# Altium schematic sheet ADC.SchDoc
size 292 x 193 mm; DocumentNumber: 3; SheetNumber: 3; SheetTotal: 11
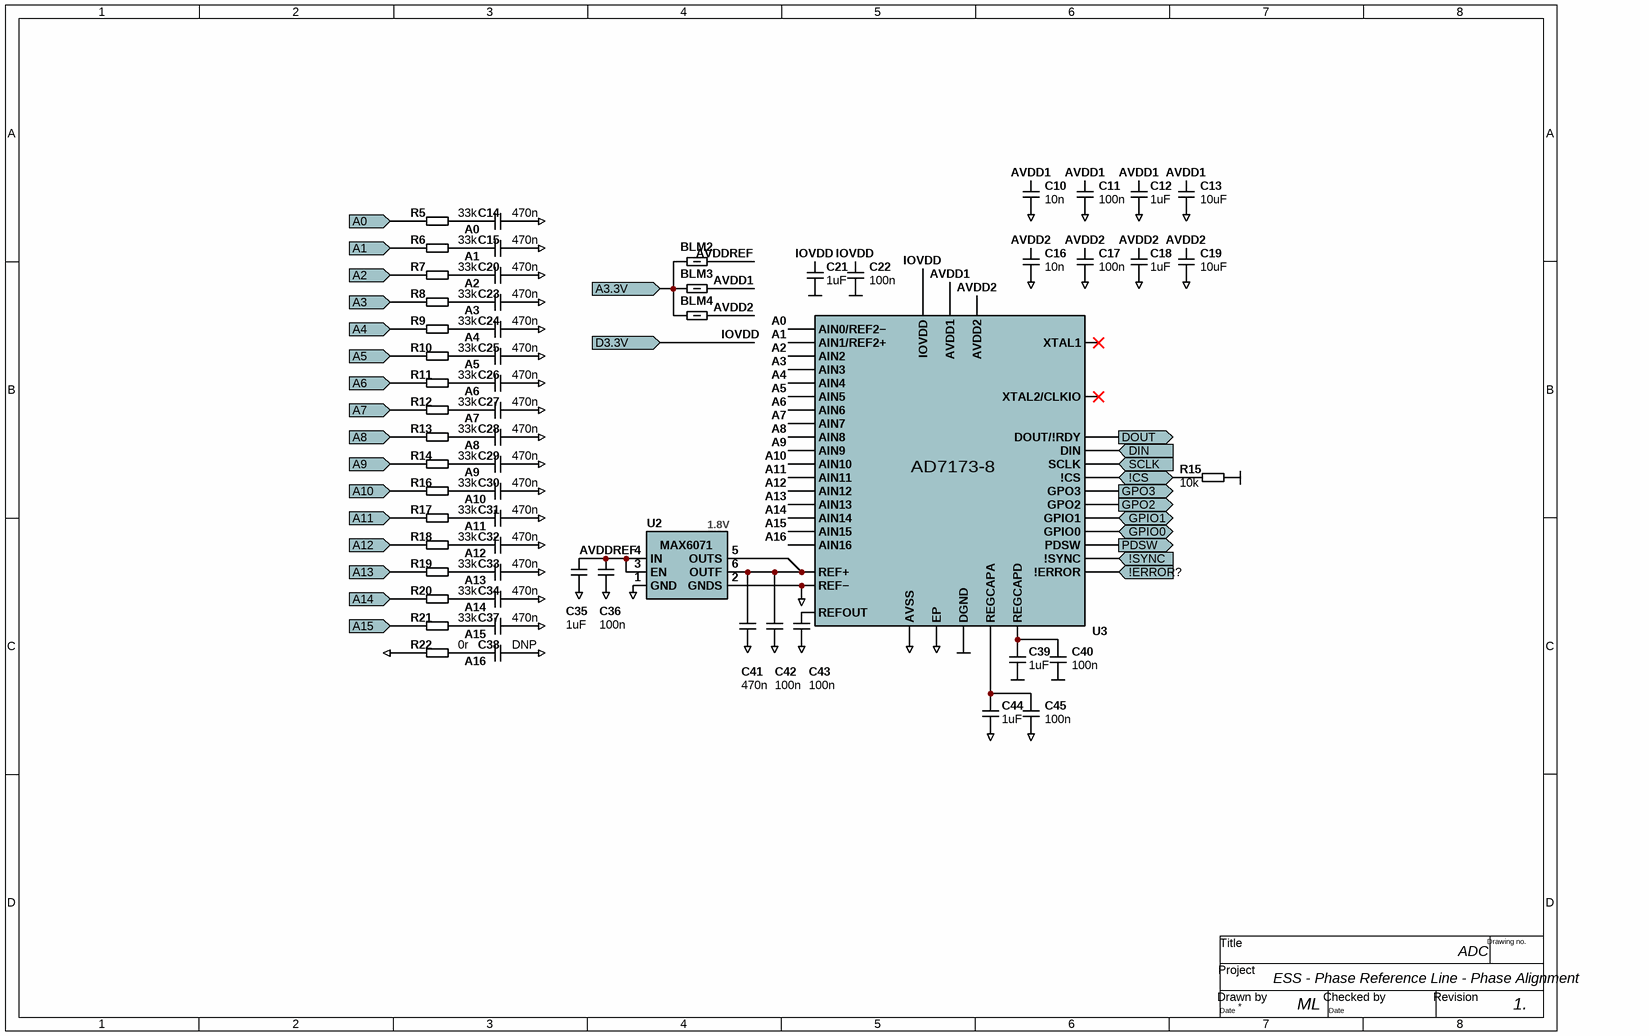
[diagram p0: ADC.SchDoc]

## Parts
BLM2  120 Ohms @ 100MHz  [0402-Inductor]  (value not drawn)
BLM3  120 Ohms @ 100MHz  [0402-Inductor]  (value not drawn)
BLM4  120 Ohms @ 100MHz  [0402-Inductor]  (value not drawn)
C10  10n  [0402-Capacitor]  (net tie, no BOM)
C11  100n  [0402-Capacitor]  (net tie, no BOM)
C12  1uF  [0805-Capacitor]
C13  10uF  [1206-capacitor]
C14  470n  [0402-Capacitor]
C15  470n  [0402-Capacitor]
C16  10n  [0402-Capacitor]  (net tie, no BOM)
C17  100n  [0402-Capacitor]  (net tie, no BOM)
C18  1uF  [0805-Capacitor]
C19  10uF  [1206-capacitor]
C20  470n  [0402-Capacitor]
C21  1uF  [0805-Capacitor]
C22  100n  [0402-Capacitor]  (net tie, no BOM)
C23  470n  [0402-Capacitor]
C24  470n  [0402-Capacitor]
C25  470n  [0402-Capacitor]
C26  470n  [0402-Capacitor]
C27  470n  [0402-Capacitor]
C28  470n  [0402-Capacitor]
C29  470n  [0402-Capacitor]
C30  470n  [0402-Capacitor]
C31  470n  [0402-Capacitor]
C32  470n  [0402-Capacitor]
C33  470n  [0402-Capacitor]
C34  470n  [0402-Capacitor]
C35  1uF  [0805-Capacitor]
C36  100n  [0402-Capacitor]  (net tie, no BOM)
C37  470n  [0402-Capacitor]
C38  DNP  [0402-Capacitor]  (net tie, no BOM)
C39  1uF  [0805-Capacitor]
C40  100n  [0402-Capacitor]  (net tie, no BOM)
C41  470n  [0402-Capacitor]  (net tie, no BOM)
C42  100n  [0402-Capacitor]  (net tie, no BOM)
C43  100n  [0402-Capacitor]  (net tie, no BOM)
C44  1uF  [0805-Capacitor]
C45  100n  [0402-Capacitor]  (net tie, no BOM)
R5  33k  [0402-RESISTOR]
R6  33k  [0402-RESISTOR]
R7  33k  [0402-RESISTOR]
R8  33k  [0402-RESISTOR]
R9  33k  [0402-RESISTOR]
R10  33k  [0402-RESISTOR]
R11  33k  [0402-RESISTOR]
R12  33k  [0402-RESISTOR]
R13  33k  [0402-RESISTOR]
R14  33k  [0402-RESISTOR]
R15  10k  [0603-RESISTOR]
R16  33k  [0402-RESISTOR]
R17  33k  [0402-RESISTOR]
R18  33k  [0402-RESISTOR]
R19  33k  [0402-RESISTOR]
R20  33k  [0402-RESISTOR]
R21  33k  [0402-RESISTOR]
R22  0r  [0402-RESISTOR]
U2  MAX6071  [SOT-23-6]  (value not drawn)
U3  AD7173-8  [LFCSP-40]  (value not drawn)

## Ports
!CS (bidir), !ERROR? (in), !SYNC (in), A0 (in), A1 (in), A2 (in), A3 (in), A3.3V (in), A4 (in), A5 (in), A6 (in), A7 (in), A8 (in), A9 (in), A10 (in), A11 (in), A12 (in), A13 (in), A14 (in), A15 (in), D3.3V (in), DIN (in), DOUT (out), GPIO0 (bidir), GPIO1 (bidir), GPO2 (out), GPO3 (out), PDSW (out), SCLK (in)

## Nets
DGND: C21.2 C22.1 C39.2 C40.1 R15.2 U3.21(DGND)
GND: C10.1 C11.1 C12.2 C13.2 C14.2 C15.2 C16.1 C17.1 C18.2 C19.2 C20.2 C23.2 C24.2 C25.2 C26.2 C27.2 C28.2 C29.2 C30.2 C31.2 C32.2 C33.2 C34.2 C35.2 C36.1 C37.2 C38.2 C41.1 C42.1 C43.1 C44.2 C45.1 R22.1 U2.1(GND) U2.2(GNDS) U3.8(AVSS) U3.39(REF−) U3.EP
!CS: R15.1 U3.17(!CS) ; port !CS
!ERROR?: U3.18(!ERROR) ; port !ERROR?
!SYNC: U3.19(!SYNC) ; port !SYNC
A0: R5.1 ; port A0
A0: C14.1 R5.2 U3.2(AIN0/REF2−)  [a separate net that carries the same name]
A1: R6.1 ; port A1
A1: C15.1 R6.2 U3.3(AIN1/REF2+)  [a separate net that carries the same name]
A2: R7.1 ; port A2
A2: C20.1 R7.2 U3.4(AIN2)  [a separate net that carries the same name]
A3: R8.1 ; port A3
A3: C23.1 R8.2 U3.5(AIN3)  [a separate net that carries the same name]
A3.3V: BLM2.1 BLM3.1 BLM4.1 ; port A3.3V
A4: R9.1 ; port A4
A4: C24.1 R9.2 U3.26(AIN4)  [a separate net that carries the same name]
A5: R10.1 ; port A5
A5: C25.1 R10.2 U3.27(AIN5)  [a separate net that carries the same name]
A6: R11.1 ; port A6
A6: C26.1 R11.2 U3.28(AIN6)  [a separate net that carries the same name]
A7: R12.1 ; port A7
A7: C27.1 R12.2 U3.29(AIN7)  [a separate net that carries the same name]
A8: R13.1 ; port A8
A8: C28.1 R13.2 U3.30(AIN8)  [a separate net that carries the same name]
A9: R14.1 ; port A9
A9: C29.1 R14.2 U3.31(AIN9)  [a separate net that carries the same name]
A10: R16.1 ; port A10
A10: C30.1 R16.2 U3.32(AIN10)  [a separate net that carries the same name]
A11: R17.1 ; port A11
A11: C31.1 R17.2 U3.33(AIN11)  [a separate net that carries the same name]
A12: R18.1 ; port A12
A12: C32.1 R18.2 U3.34(AIN12)  [a separate net that carries the same name]
A13: R19.1 ; port A13
A13: C33.1 R19.2 U3.35(AIN13)  [a separate net that carries the same name]
A14: R20.1 ; port A14
A14: C34.1 R20.2 U3.36(AIN14)  [a separate net that carries the same name]
A15: R21.1 ; port A15
A15: C37.1 R21.2 U3.37(AIN15)  [a separate net that carries the same name]
A16: C38.1 R22.2 U3.1(AIN16)
AVDD1: BLM3.2 C10.2 C11.2 C12.1 C13.1 U3.9(AVDD1)
AVDD2: BLM4.2 C16.2 C17.2 C18.1 C19.1 U3.10(AVDD2)
AVDDREF: BLM2.2 C35.1 C36.2 U2.3(EN) U2.4(IN)
DIN: U3.15(DIN) ; port DIN
DOUT: U3.14(DOUT/!RDY) ; port DOUT
GPIO0: U3.23(GPIO0) ; port GPIO0
GPIO1: U3.24(GPIO1) ; port GPIO1
GPO2: U3.25(GPO2) ; port GPO2
GPO3: U3.38(GPO3) ; port GPO3
IOVDD: C21.1 C22.2 U3.20(IOVDD) ; port D3.3V
PDSW: U3.11(PDSW) ; port PDSW
SCLK: U3.16(SCLK) ; port SCLK
NetC39_1: C39.1 C40.2 U3.22(REGCAPD)
NetC41_2: C41.2 C42.2 U2.5(OUTS) U2.6(OUTF) U3.40(REF+)
NetC43_2: C43.2 U3.6(REFOUT)
NetC44_1: C44.1 C45.2 U3.7(REGCAPA)

Not connected (* = marked no-connect by the designer): U3 12(XTAL1)* 13(XTAL2/CLKIO)*

## Notes on the sheet
- (near U2) 1.8V
- ESS - Phase Reference Line - Phase Alignment
- ADC
- ML
- 1.
- Title
- Project
- Drawing no.
- Date
- Drawn by
- Checked by
- Revision

## Library data of the parts
BLM2-BLM4 = BLM15AX121SZ1D: 120 Ohms @ 100MHz 1 Power, Signal Line Ferrite Bead 0402 (1005 Metric) 700mA 130mOhm; Case: 0402; Supplier 1: Digi-Key; Supplier Part Number 1: 490-16510-1-ND; HelpURL: https://www.murata.com/en-us/products/productdata/8796748677150/QNFA9118.pdf
C10 C11 C14-C17 C20 C22-C34 C36 C37 C40-C43 C45 = C_0402: Capacitor 0402; Dielectric: X7R/C0G; Tolerance: ±20%; Voltage Rating: 16V; Case: 0402
  C10 C16: Value: 10n
  C11 C17 C22 C36 C40 C42 C43 C45: Value: 100n
  C14 C15 C20 C23-C34 C37 C41: Value: 470n
C12 C18 C21 C35 C39 C44 = C_0805: Capacitor 0805; Dielectric: X7R/C0G; Tolerance: ±20%; Voltage Rating: 16V; Value: 1uF; Case: 0805
C13 C19 = C_1206: Capacitor 1206; Voltage Rating: 16V; Dielectric: X7R/C0G; Tolerance: ±20%; Value: 10uF; Case: 1206
C38 = C_0402: Capacitor 0402; Value: 470n; Dielectric: X7R/C0G; Tolerance: ±20%; Voltage Rating: 16V; Case: 0402
R5-R14 R16-R22 = R_0402: Resistor 0402; Tolerance: ±1%; Case: 0402
  R5-R14 R16-R21: Value: 33k
  R22: Value: 0r
R15 = R_0603: Resistor 0603; Tolerance: ±1%; Value: 10k; Case: 0603
U2 = MAX6071-1.8: Low-Noise, High-Precision Series / 1.8V Voltage Reference; Case: SOT23-6; HelpURL: https://datasheets.maximintegrated.com/en/ds/MAX6070-MAX6071.pdf; Supplier Part Number 1: 3257466; Supplier 1: Farnel
U3 = AD7173-8: Highly Integrated 24 Bit Sigma-Delta ADC / 8-/16-Channel / Low Power / 31.25 kSPS; Case: LFCSP40; HelpURL: https://www.analog.com/media/en/technical-documentation/data-sheets/AD7173-8.pdf; Supplier Part Number 1: 2377349